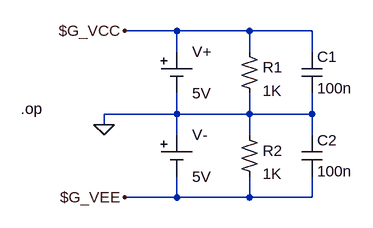
[diagram p0: schematic Boltz-0-power.asc]
Boltz-0-power.asc, the LTspice schematic file:
Version 4
SHEET 1 880 680
WIRE -112 240 -144 240
WIRE -64 240 -112 240
WIRE 48 240 -64 240
WIRE 144 240 48 240
WIRE -64 272 -64 240
WIRE 48 272 48 240
WIRE 144 272 144 240
WIRE -64 368 -64 336
WIRE -64 368 -176 368
WIRE 48 368 48 336
WIRE 48 368 -64 368
WIRE 144 368 144 336
WIRE 144 368 48 368
WIRE -176 384 -176 368
WIRE -64 400 -64 368
WIRE 48 400 48 368
WIRE 144 400 144 368
WIRE -64 496 -64 464
WIRE -64 496 -144 496
WIRE 48 496 48 464
WIRE 48 496 -64 496
WIRE 144 496 144 464
WIRE 144 496 48 496
FLAG -176 384 0
FLAG -144 496 $G_VEE
FLAG -144 240 $G_VCC
DATAFLAG -112 240 "$"
SYMBOL Misc/cell -64 272 R0
SYMATTR InstName V+
SYMATTR Value 5V
SYMBOL Misc/cell -64 400 R0
SYMATTR InstName V-
SYMATTR Value 5V
SYMBOL res2 32 272 R0
SYMATTR InstName R1
SYMATTR Value 1K
SYMBOL res2 32 400 R0
SYMATTR InstName R2
SYMATTR Value 1K
SYMBOL cap 128 272 R0
SYMATTR InstName C1
SYMATTR Value 100n
SYMBOL cap 128 400 R0
SYMATTR InstName C2
SYMATTR Value 100n
TEXT -304 360 Left 2 !.op

The netlist it stands for:
* Boltz-0-power.asc
V+ $G_VCC 0 5V
V- 0 $G_VEE 5V
R1 $G_VCC 0 1K
R2 0 $G_VEE 1K
C1 $G_VCC 0 100n
C2 0 $G_VEE 100n
.op
.backanno
.end